# EAGLE design MODULO 1 RELE (EAGLE 7.5.0)
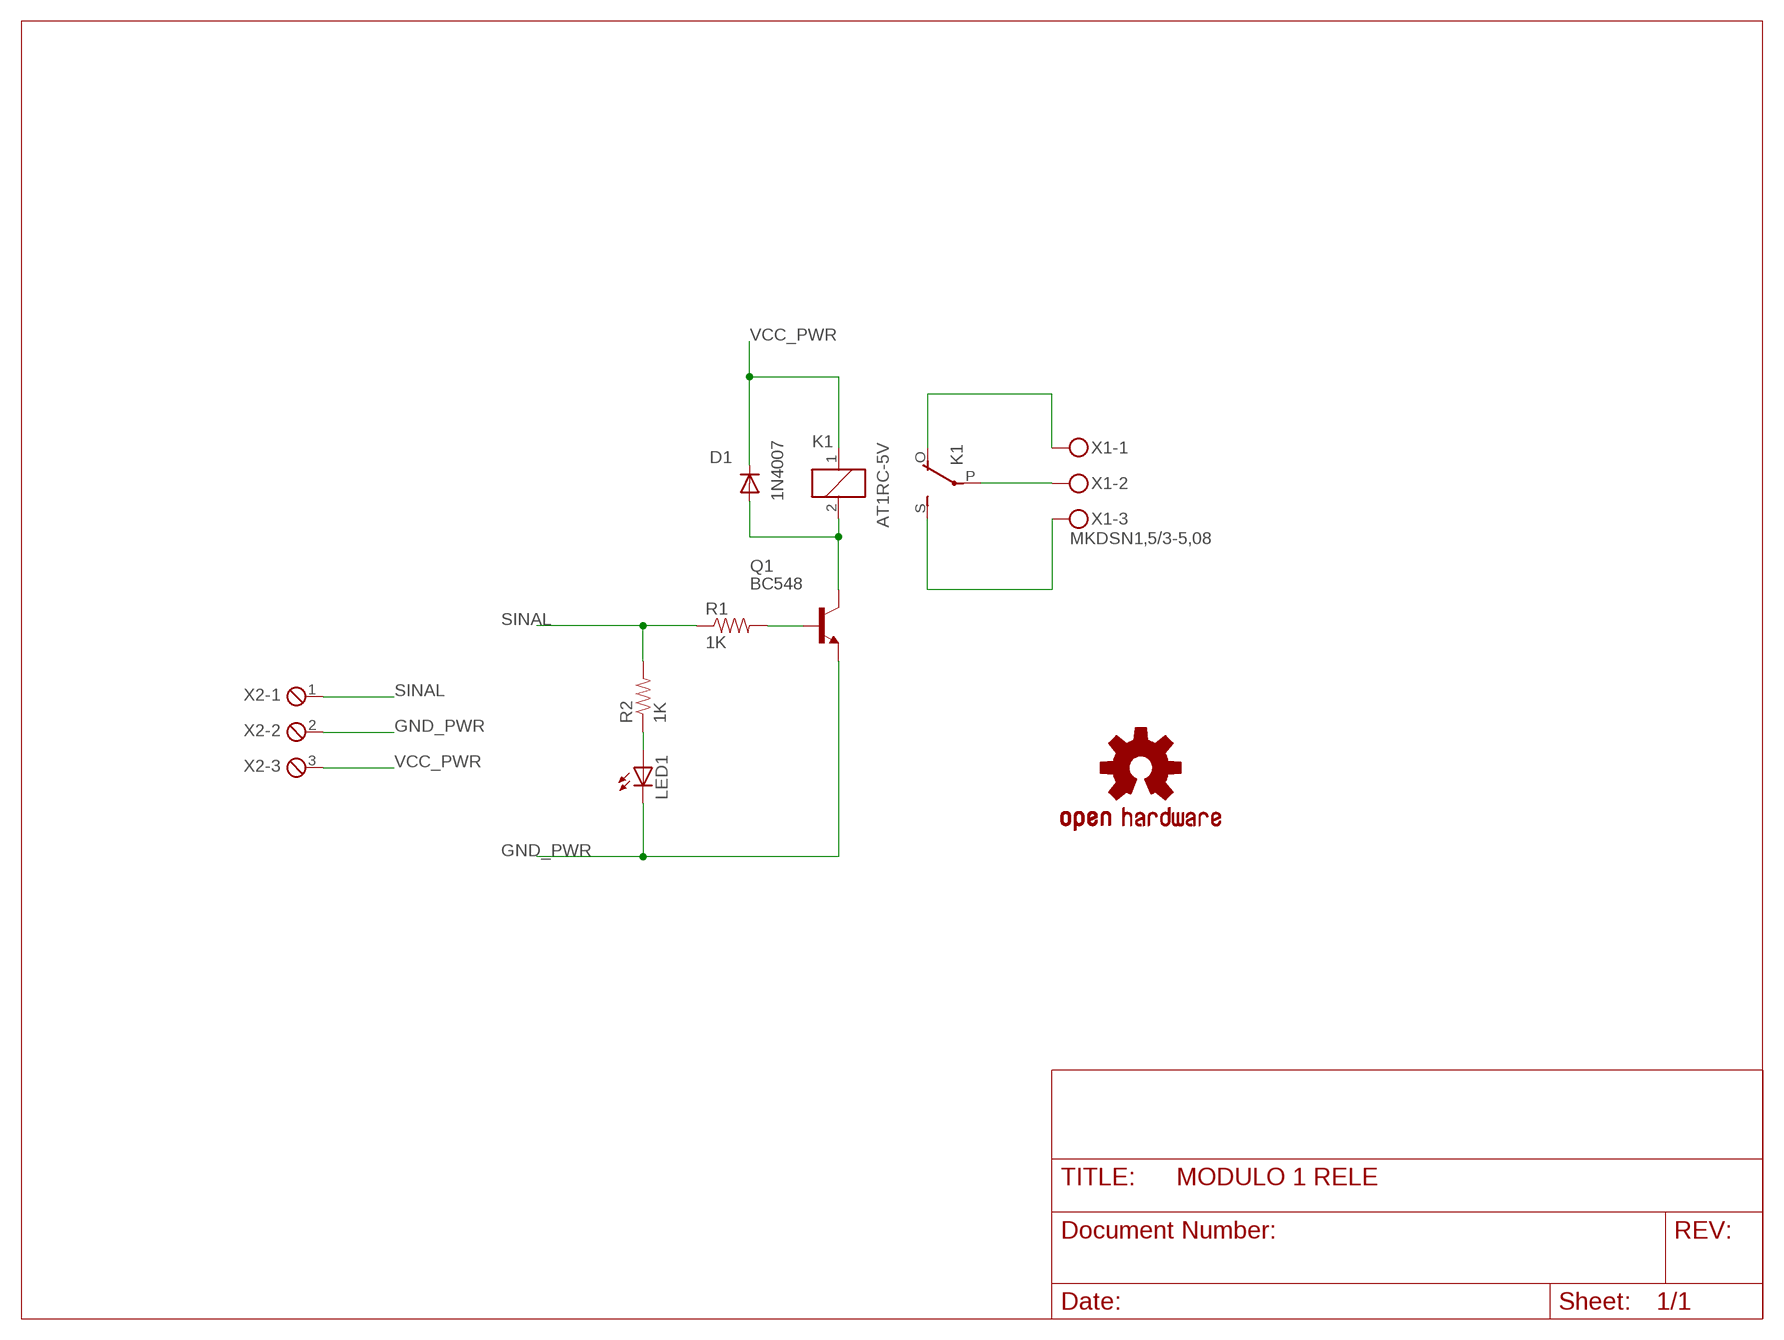
[diagram p0: schematic, sheet 1]

## Parts
D1  1N4007  DIODEPTH  [DIODE-1N4001]
K1  AT1RC-5V  G5L  [G5LE]
LED1  LED3MM  [LED3MM]
LOGO1  OSHW-LOGOM  [OSHW-LOGO-M]
Q1  BC548  [TO92-EBC]
R1  1K  RESISTORPTH-1/4W  [AXIAL-0.4]
R2  1K  RESISTORPTH-1/4W  [AXIAL-0.4]
X1  MKDSN1,5/3-5,08  [MKDSN1,5/3-5,08]
X2  MPT3  [3POL254]

## Nets
GND_PWR: LED1.K(C) Q1.E X2.2
N$1: Q1.B R1.P$2
N$2: K1.O(2:O) X1.1
N$3: LED1.A R2.P$1
N$6: K1.P(2:P) X1.2
N$7: K1.S(2:S) X1.3
N$8: D1.A K1.2 Q1.C
SINAL: R1.P$1 R2.P$2 X2.1
VCC_PWR: D1.C K1.1 X2.3

## Library data of the parts
D1 = SparkFun:DIODE: Diode These are standard reverse protection diodes and small signal diodes. SMA package can handle up to about 1A. SOD-323 can handle about 200mA. What the SOD-323 package when ordering, there are some mfgs out there that are 5-pin packages.
K1 = relay:G5L: RELAY 1 x switch, 10 A/120 V AC, 8 A/30 V ADC, Omron; OC_FARNELL: unknown; OC_NEWARK: unknown
LED1 = SparkFun:LED: LEDs Standard schematic elements and footprints for 5mm, 3mm, 1206, and 0603 sized LEDs. 5mm - Spark Fun Electronics SKU : COM-00529 (and others)
LOGO1 = SparkFun-Aesthetics:OSHW-LOGO: Open Source Hardware Logo This logo indicates the piece of hardware it is found on incorporates a OSHW license and/or adheres to the definition of open source hardware found here: http://freedomdefined.org/OSHW
Q1 = transistor-npn:BC548*: NPN Transistor
R1 R2 = SparkFun:RESISTOR: Resistor Basic schematic elements and footprints for 0603, 1206, and PTH resistors.
X1 = con-phoenix-508:MKDSN1,5/3-5,08: MKDSN 1,5/ 3-5,08 Printklemme Nennstrom: 13,5 A Nennspannung: 250 V Rastermaß: 5,08 mm Polzahl: 3 Anschlussart: Schraubanschluss Montage: Löten Anschlussrichtung Leiter/Platine: 0 ° Artikelnummer: 1729131 Source: http://eshop.phoenixcontact.com .. 1729131.pdf; MPN: SMKDSN1,5/3-5,08; OC_FARNELL: 1792904; OC_NEWARK: 70R0299
X2 = con-phoenix-254:MPT3: PHOENIX CONNECTOR; OC_FARNELL: unknown; OC_NEWARK: unknown

## Board
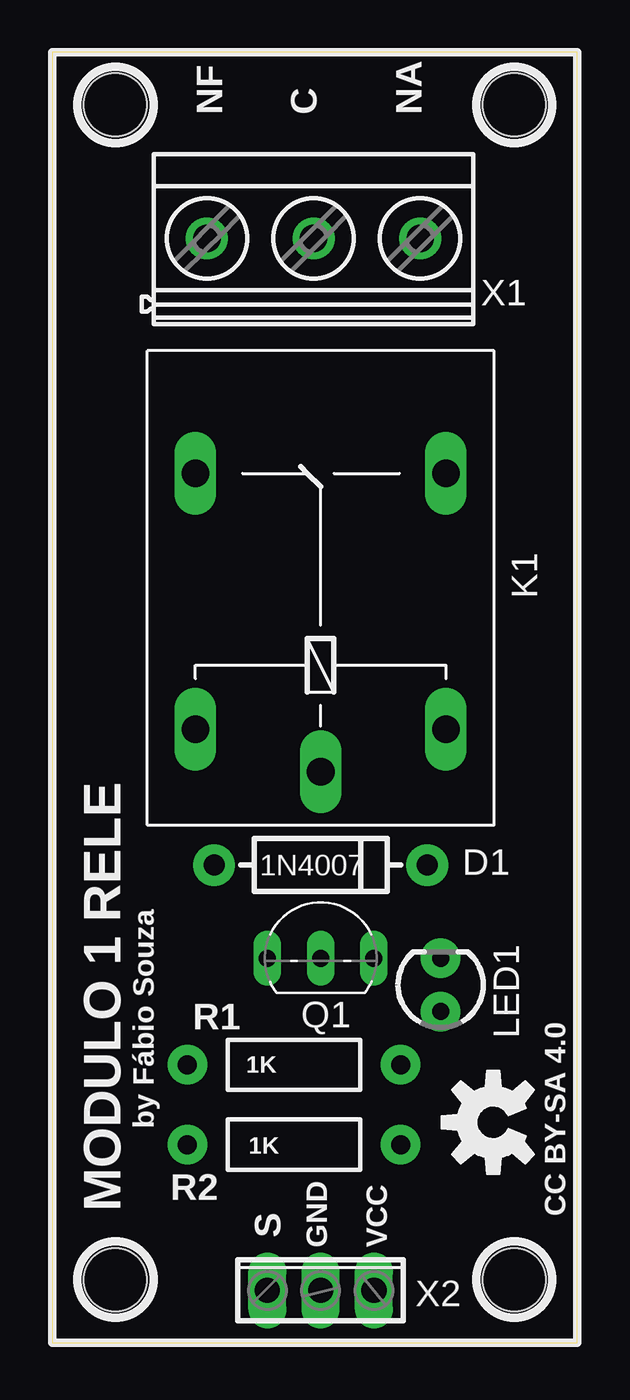
[diagram p1: board, top side]
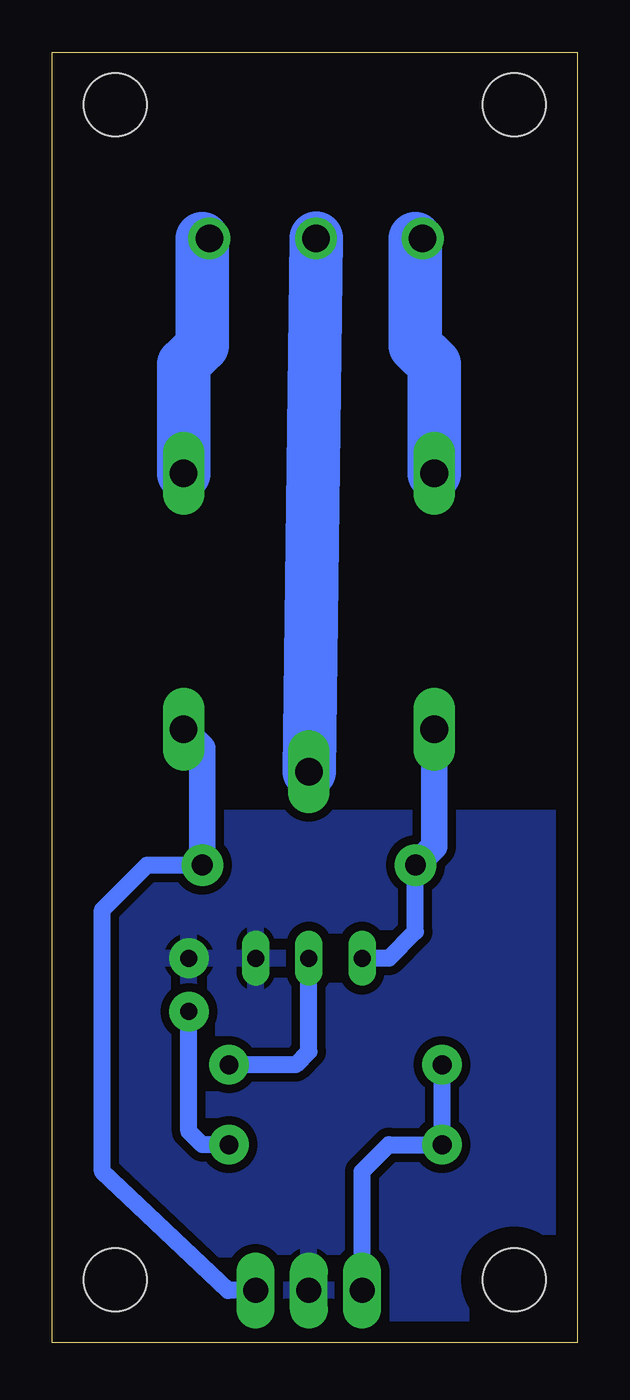
[diagram p2: board, bottom side, seen from below]

Size 25 x 61.5 mm. Coordinates in mm from the lower left corner, seen from the top.
Outline: 0,0 25,0 25,61.5 0,61.5 0,0
Copper layers (1*16): Top 0.035mm / dielectric 1.5mm / Bottom 0.035mm
Design rules "default": minimum track width 10mil, minimum drill 24mil, track to track 8mil, track to pad 8mil, pad to pad 8mil, via to via 8mil, smd to smd 8mil, copper to edge 40mil, drill to drill 8mil, minimum pad ring 10mil, minimum via ring 8mil, stop-mask expansion 4mil, vias tented up to drill 0mil, thermal gap 10mil
Holes 3 mm at 3,3 22,3 22,59 3,59

### Footprints (pad centres in the part's own frame; a part is rotated, then mirrored left to right if it is on the bottom)
DIODE-1N4001 = drill 1 pad 1.981: A -5.08,0; C 5.08,0
G5LE = drill 1.321 long: 1 -7.493,-5.969; 2 -7.493,5.969; O 4.699,5.969; P -9.525,0; S 4.699,-5.969
LED3MM = drill 0.813 pad 1.88: A -1.27,0; K 1.27,0
TO92-EBC = drill 0.813 long: B 0,-1.27; C -2.54,-1.27; E 2.54,-1.27
AXIAL-0.4 = drill 0.9 pad 1.88: P$1 -5.08,0; P$2 5.08,0
MKDSN1,5/3-5,08 = drill 1.3 pad 2: 1 -7.641,0.025; 2 -2.561,0.025; 3 2.519,0.025
3POL254 = drill 1.2 long: 1 -2.54,0; 2 0,0; 3 2.54,0

### Placement (x,y rotation side)
D1  12.78,22.77 0 top
K1  12.78,36.73 90 top
LED1  18.5,17.05 90 top
LOGO1  21,10.5 90 top
Q1  12.78,19.59 0 top
R1  11.51,13.24 0 top
R2  11.51,9.43 180 top
X1  15,52.61 0 top
X2  12.78,2.49 0 top

### Tracks (layer width: path | path; a pad name or v marks a point on that pad's centre or on a via)
GND_PWR
  pour Bottom (isolate 0.406): 0.4,24.99 24.84,24.99 24.53,0.54 0.4,0.54
N$1
  Bottom 0.813: Q1.B 12.78,13.88 13.41,13.24 R1.P$2
N$2
  Bottom 1.27: 7.7,52.61 X1.1
  Bottom 2.54: K1.O 6.81,46.64 7.7,47.53 7.7,52.61
N$3
  Bottom 0.813: LED1.A 18.5,10.06 17.86,9.43 R2.P$1
N$6
  Bottom 1.27: 12.76,27.23 K1.P
  Bottom 2.54: 12.76,27.23 X1.2
N$7
  Bottom 1.27: 17.86,52.61 X1.3
  Bottom 2.54: K1.S 18.75,46.64 17.86,47.53 17.86,52.61
N$8
  Bottom 0.813: D1.A 7.7,19.59 8.97,18.32 Q1.C
  Bottom 1.27: K1.2 6.81,23.65 D1.A
SINAL
  Bottom 0.813: R1.P$1 R2.P$2 8.97,9.43 10.24,8.16 X2.1
VCC_PWR
  Bottom 0.813: X2.3 16.63,2.49 22.62,8.16 22.62,20.64 20.49,22.77 D1.C
  Bottom 1.27: D1.C 17.86,28.35 K1.1

### Text on the board
tPlace: NF | C | NA | by Fábio Souza | MODULO 1 RELE | CC BY-SA 4.0 | S | GND | VCC